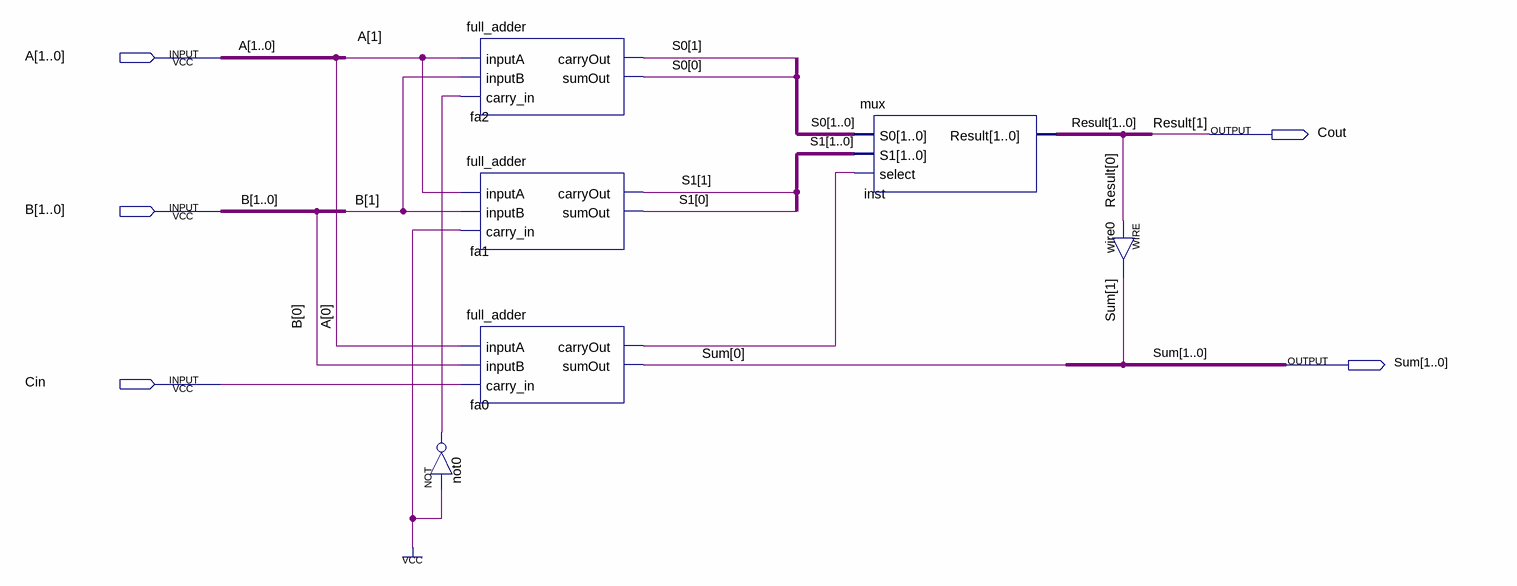
[diagram p0: schematic sheet]
// Quartus schematic conditional_sum_adder.bdf as structural Verilog: 6 symbols, 5 pins
module conditional_sum_adder (
  input  [1:0] A,
  input  [1:0] B,
  input  Cin,
  output Cout,
  output [1:0] Sum
);

  wire fa0_carryout, not0_out;
  wire [0:0] Result;
  wire [1:0] S0, S1;

  full_adder fa2 (.inputA(A[1]), .inputB(B[1]), .carry_in(not0_out), .carryOut(S0[1]), .sumOut(S0[0]));
  full_adder fa1 (.inputA(A[1]), .inputB(B[1]), .carry_in(1'b1), .carryOut(S1[1]), .sumOut(S1[0]));
  full_adder fa0 (.inputA(A[0]), .inputB(B[0]), .carry_in(Cin), .carryOut(fa0_carryout), .sumOut(Sum[0]));
  not not0 (not0_out, 1'b1);
  mux inst (.S0(S0), .S1(S1), .select(fa0_carryout), .Result({Cout, Result[0]}));
  assign Sum[1] = Result[0];  // WIRE wire0

  // Other names for the same wires on the sheet: Result[1] = Cout
endmodule
